# Altium schematic sheet ATTINY85.SchDoc
size A4; SheetNumber: 3; SheetTotal: 4
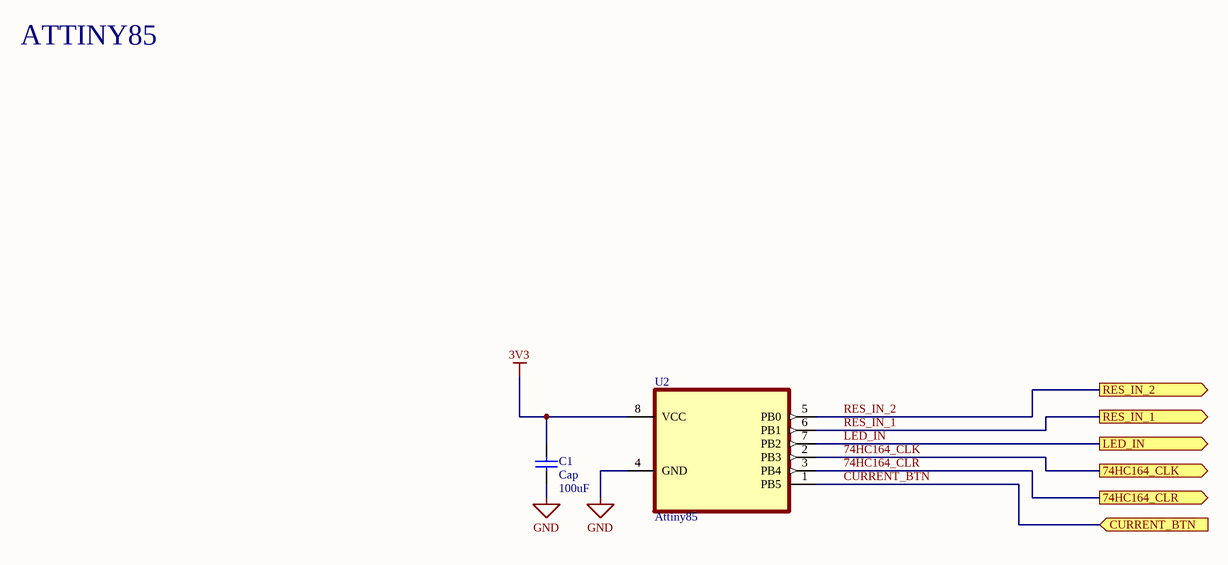
[diagram p0: ATTINY85.SchDoc]

## Parts
C1  Cap  value 100uF  [RAD-0.3]
U2  Attiny85  [SOIC127P798X216-8N]

## Ports
74HC164_CLK (out), 74HC164_CLR (out), CURRENT_BTN (in), LED_IN (out), RES_IN_1 (out), RES_IN_2 (out)

## Nets
3V3: C1.2 U2.8(VCC)
GND: C1.1 U2.4(GND)
74HC164_CLK: U2.2(PB3) ; port 74HC164_CLK
74HC164_CLR: U2.3(PB4) ; port 74HC164_CLR
CURRENT_BTN: U2.1(PB5) ; port CURRENT_BTN
LED_IN: U2.7(PB2) ; port LED_IN
RES_IN_1: U2.6(PB1) ; port RES_IN_1
RES_IN_2: U2.5(PB0) ; port RES_IN_2

## Notes on the sheet
- ATTINY85

## Library data of the parts
C1 = Cap: Capacitor; Published: 8-Jun-2000; LatestRevisionDate: 17-Jul-2002; LatestRevisionNote: Re-released for DXP Platform.; PackageReference: RAD-0.3; Publisher: Altium Limited; PackageDescription: Radial Cap, Thru-Hole; 2 Leads; 0.3 in Pin Spacing
U2 = ATTINY85-20SH: AVR ATtiny Microcontroller IC 8-Bit 20MHz 8KB _4K x 16_ FLASH 8-SOIC; MF: Microchip; Availability: Unavailable; MP: ATTINY85-20SH; SnapEDA_Link: https://www.snapeda.com/parts/ATTINY85-20SH/Microchip/view-part/641442/?ref=snap; Value: *; Price: None; Package: SOIC-8 Microchip